# EAGLE design main-oscillator (EAGLE 7.2.0)
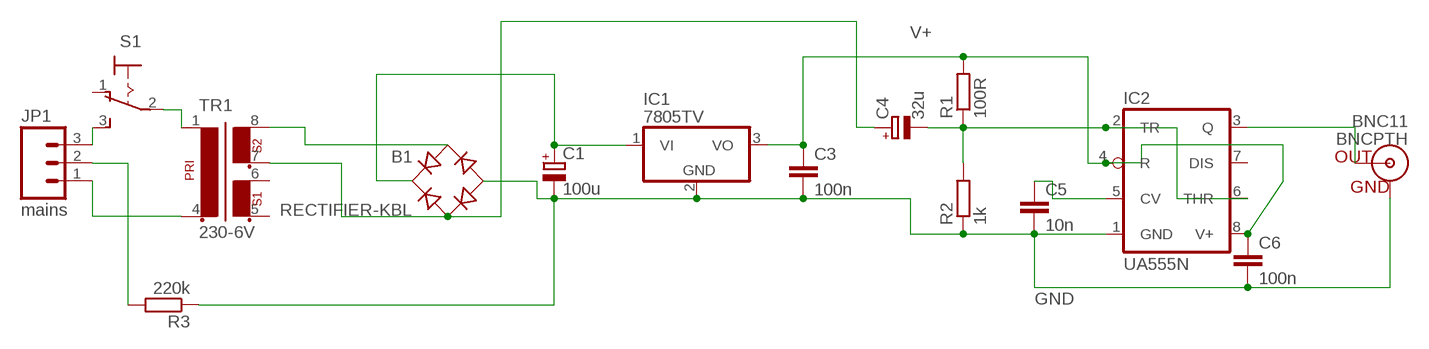
[diagram p0: schematic, sheet 1]

## Parts
B1  RECTIFIER-KBL  B-DIL  [B-DIL]
BNC11  BNCPTH  [BNC]
C1  100u  CPOL-EUE2.5-7  [E2,5-7]
C3  100n  C-EU050-024X044  [C050-024X044]
C4  32u  CPOL-EUE5-13  [E5-13]
C5  10n  C-EU025-025X050  [C025-025X050]
C6  100n  C-EU050-024X044  [C050-024X044]
IC1  7805TV  [TO220V]
IC2  UA555N  [DIL08]
JP1  mains  M03-SCREW-5MM  [SCREWTERMINAL-5MM-3]
R1  100R  R-EU_0207/10  [0207/10]
R2  1k  R-EU_0207/10  [0207/10]
R3  220k  R-EU_0207/10  [0207/10]
S1  320-916  [320-916]
TR1  230-6V  EE20-2  [EE20-2]

## Nets
GND: B1.- BNC11.GND C1.- C3.2 C5.2 C6.2 IC1.2(GND) IC2.1(GND) R2.1 R3.1
N$1: S1.2(P) TR1.1
N$2: B1.AC2 C4.+ TR1.7
N$3: JP1.1 TR1.4
N$4: JP1.2 R3.2
N$5: B1.+ C1.+ IC1.1(VI)
N$6: B1.AC1 TR1.8
N$7: C5.1 IC2.5(CV)
N$8: C4.- IC2.2(TR) IC2.6(THR) R1.1 R2.2
N$9: BNC11.S(OUT) IC2.3(Q)
N$10: JP1.3 S1.3(S)
V+: C3.1 C6.1 IC1.3(VO) IC2.4(R) IC2.8(V+) R1.2
Unconnected: IC2.7(DIS) S1.1(O) TR1.5 TR1.6

## Library data of the parts
B1 = rectifier:B-DIL: RECTIFIER
BNC11 = SparkFun-Connectors:BNC: BNC Connector, Mouser Part# 5227161
C1 C4 = rcl:CPOL-EU: POLARIZED CAPACITOR, European symbol
C3 C6 = resistor:C-EU: CAPACITOR, European symbol
C5 = rcl:C-EU: CAPACITOR, European symbol
IC1 = linear:78*: Positive VOLTAGE REGULATOR Source: http://cache.national.com/ds/LM/LM78L05.pdf http://www.fairchildsemi.com/ds/LM/LM7805.pdf
IC2 = linear:*555: TIMER
JP1 = SparkFun-Connectors:M03: Header 3 Standard 3-pin 0.1" header. Use with straight break away headers (SKU : PRT-00116), right angle break away headers (PRT-00553), swiss pins (PRT-00743), machine pins (PRT-00117), and female headers (PRT-00115). Molex polarized connector foot print use with SKU : PRT-08232 with associated crimp pins and housings.; STOREFRONT_ID: PRT-08433
R1-R3 = resistor:R-EU_: RESISTOR, European symbol
S1 = switch:320-916: TOGGLE SWITCH distributor RS Components
TR1 = trafo:EE20-2: TRANSFORMER 1 primary winding, 2 secondary windings ERA

## Board
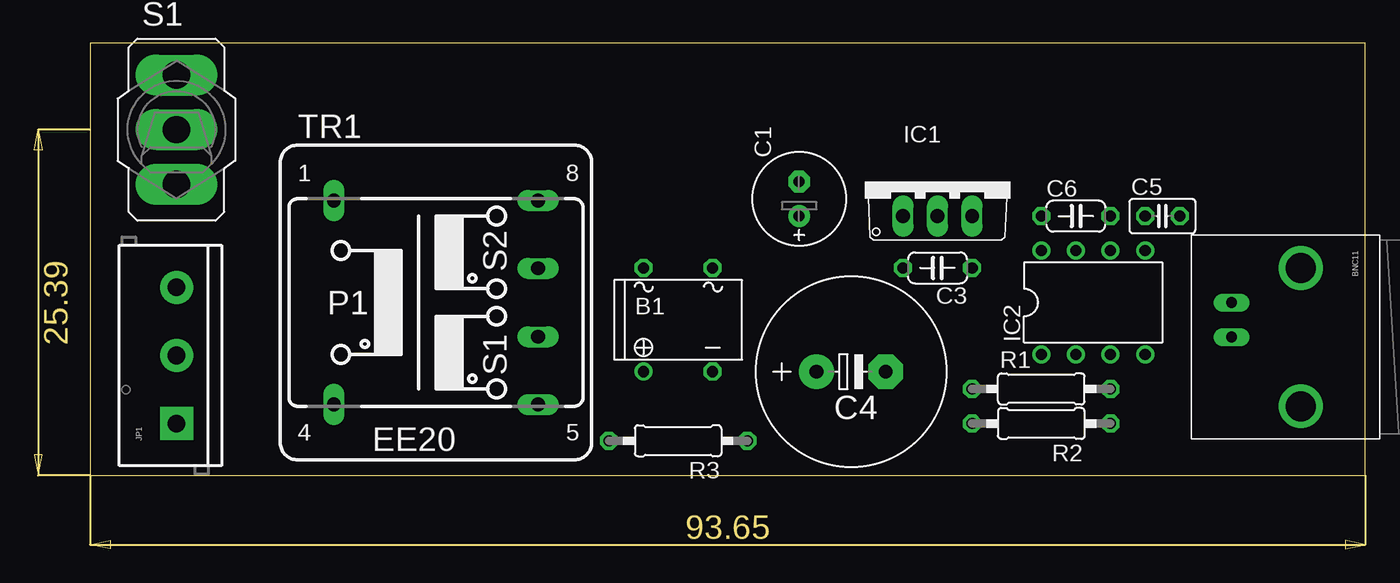
[diagram p1: board, top side]
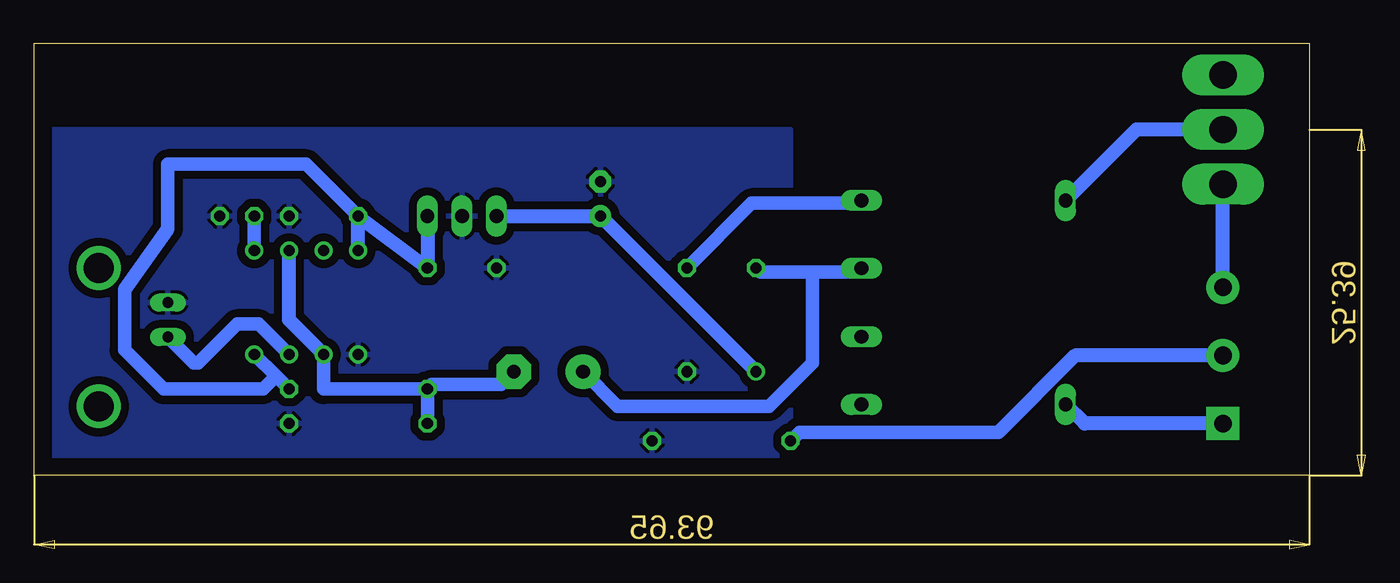
[diagram p2: board, bottom side, seen from below]

Size 93.65 x 31.74 mm. Coordinates in mm from the lower left corner, seen from the top.
Outline: 0,0 93.65,0 93.65,31.74 0,31.74 0,0
Copper layers (1*16): Top 0.035mm / dielectric 1.5mm / Bottom 0.035mm
Design rules "default": minimum track width 1mm, minimum drill 1mm, track to track 0.6mm, track to pad 8mil, pad to pad 8mil, via to via 8mil, smd to smd 8mil, copper to edge 50mil, drill to drill 1.3mm, minimum pad ring 10mil, minimum via ring 8mil, stop-mask expansion 4mil, vias tented up to drill 0mil, thermal gap 10mil

### Footprints (pad centres in the part's own frame; a part is rotated, then mirrored left to right if it is on the bottom)
B-DIL = drill 0.813: + -2.54,-3.81 | drill 0.813 octagon: - 2.54,-3.81; AC1 2.54,3.81; AC2 -2.54,3.81
BNC = drill 2.2: 3 -5.08,5.08; 4 5.08,5.08 | drill 0.8 long: GND -2.54,0; S 0,0
E2,5-7 = drill 0.813 pad 1.6: + -1.27,0 | drill 0.813 pad 1.6 octagon: - 1.27,0
C050-024X044 = drill 0.813 octagon: 1 -2.54,0; 2 2.54,0
E5-13 = drill 1.016 pad 2.54: + -2.54,0 | drill 1.016 pad 2.54 octagon: - 2.54,0
C025-025X050 = drill 0.813 octagon: 1 -1.27,0; 2 1.27,0
TO220V = drill 1.016 long: 1 -2.54,-2.54; 2 0,-2.54; 3 2.54,-2.54
DIL08 = drill 0.813 pad 1.27: 1 -3.81,-3.81; 2 -1.27,-3.81; 3 1.27,-3.81; 4 3.81,-3.81; 5 3.81,3.81; 6 1.27,3.81; 7 -1.27,3.81; 8 -3.81,3.81
SCREWTERMINAL-5MM-3 = drill 1.3 pad 2.413 square: 1 0,0 | drill 1.3 pad 2.413: 2 5,0; 3 10,0
0207/10 = drill 0.813 octagon: 1 -5.08,0; 2 5.08,0
320-916 = drill 2.007 long: 1 0,4.013; 2 0,0; 3 0,-4.013
EE20-2 = drill 1.016 long: 1 -7.493,7.493; 4 -7.493,-7.493; 5 7.493,-7.493; 6 7.493,-2.515; 7 7.493,2.515; 8 7.493,7.493

### Placement (x,y rotation side)
B1  43.18,11.43 0 top
BNC11  83.82,10.16 270 top
C1  52.07,20.32 90 top
C3  62.23,15.24 180 top
C4  55.88,7.62 0 top
C5  78.74,19.05 0 top
C6  72.39,19.05 0 top
IC1  62.23,21.59 0 top
IC2  73.66,12.7 0 top
JP1  6.35,3.81 90 top
R1  69.85,6.35 0 top
R2  69.85,3.81 180 top
R3  43.18,2.54 180 top
S1  6.35,25.4 0 top
TR1  25.4,12.7 0 top

### Tracks (layer width: path | path; a pad name or v marks a point on that pad's centre or on a via)
GND
  pour Bottom: 38.1,25.4 38.1,1.27 92.71,1.27 92.71,25.4
N$1
  Bottom 1.016: S1.2 12.7,25.4 TR1.1
N$2
  Bottom 1: B1.AC2 40.32,14.92 36.51,14.92 | 36.51,14.92 33.02,14.92 TR1.7 | C4.+ 50.8,5.08 39.69,5.08 36.51,8.26 36.51,14.92
N$3
  Bottom 1: 17.78,5.4 TR1.4
  Bottom 1.016: JP1.1 16.51,3.81 TR1.4
N$4
  Bottom 1: R3.2 37.47,3.17 22.86,3.17
  Bottom 1.016: JP1.2 17.23,8.81 22.86,3.17
N$5
  Bottom 1.016: IC1.1 C1.+ B1.+
N$6
  Bottom 1: B1.AC1 40.96,20 33.02,20 TR1.8
N$7
  Bottom 1: C5.1 IC2.5
N$8
  Bottom 1: R1.1 R2.2 | IC2.2 72.39,6.35 R1.1 | C4.- 59.37,6.67 64.45,6.67 R1.1
  Bottom 1.016: IC2.2 74.93,11.43 IC2.6
N$9
  Bottom 1: BNC11.S 81.92,8.26 81.6,8.26 78.74,11.11 77.15,11.11 IC2.3
N$10
  Bottom 1.016: JP1.3 S1.3
V+
  Bottom 1: IC2.4 75.88,7.3 | 75.88,7.3 R1.2 | 75.88,7.3 76.83,6.35 84.14,6.35 87,9.21 87,13.65 83.82,18.1 83.82,22.86 73.66,22.86 C6.1
  Bottom 1.016: IC2.8 C6.1 C3.1 IC1.3